# Altium schematic sheet ON_OFF.SchDoc
size A4
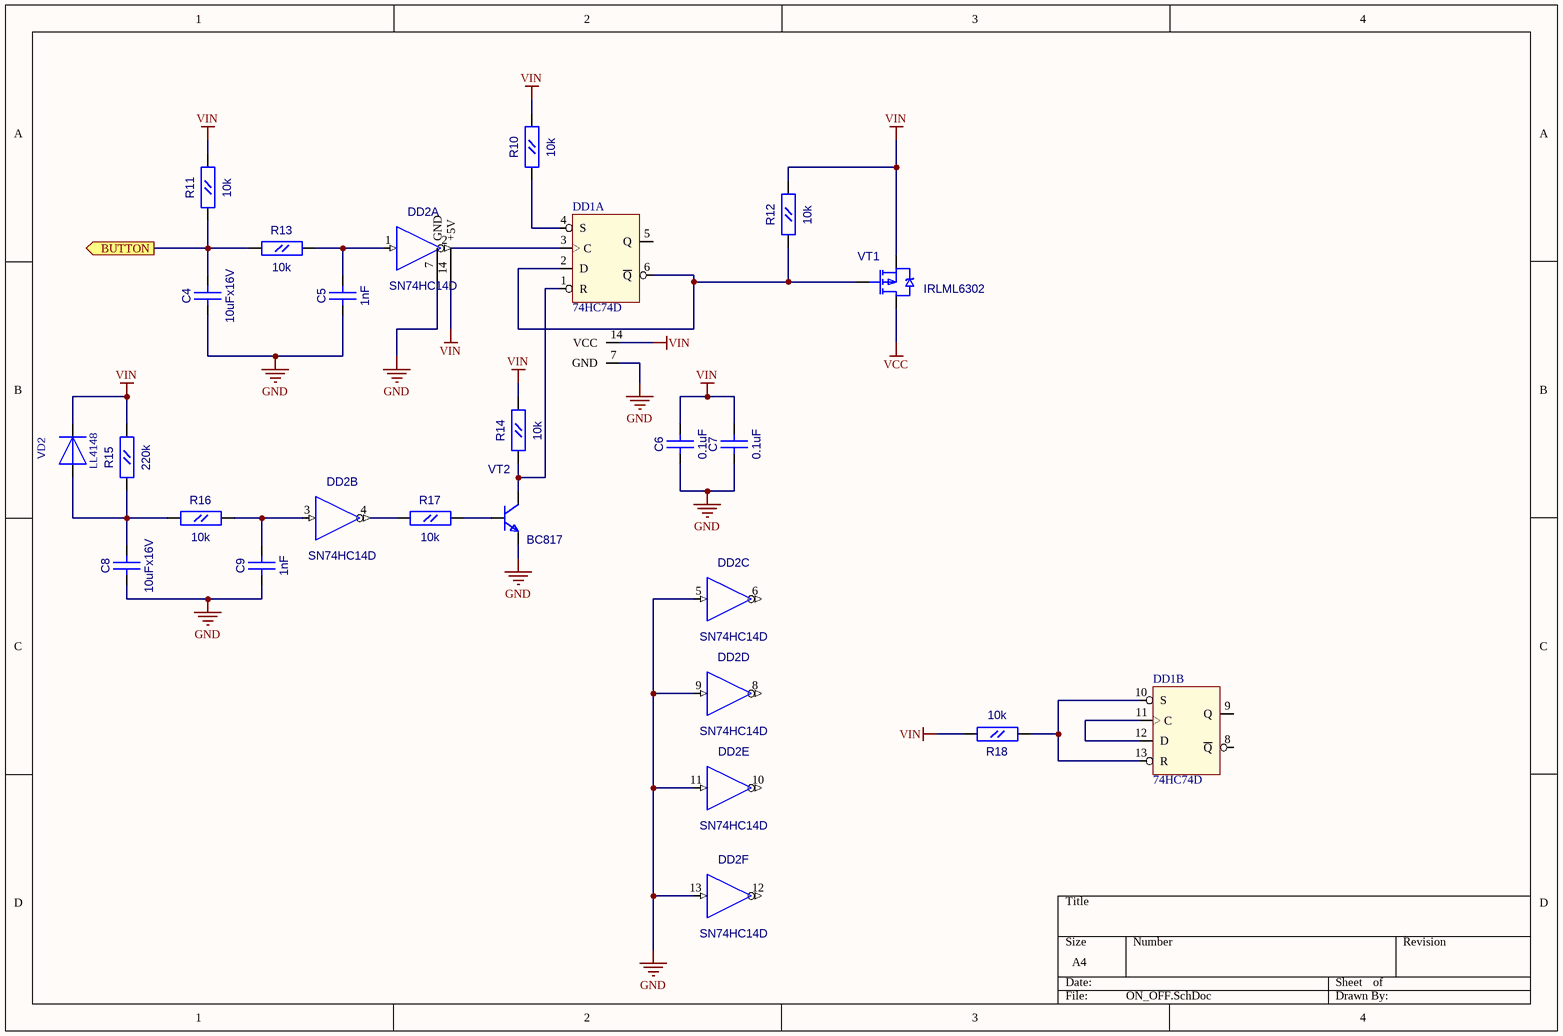
[diagram p0: ON_OFF.SchDoc]

## Parts
C4  10uFx16V  [CC0805]
C5  1nF  [CC0805]
C6  0.1uF  [CC0805]
C7  0.1uF  [CC0805]
C8  10uFx16V  [CC0805]
C9  1nF  [CC0805]
DD1  74HC74D  [SO14]  (parts A,B of 2)
DD2  SN74HC14D  [SO14]  (parts A,B,C,D,E,F of 6)
R10  10k  [RC0805]
R11  10k  [RC0805]
R12  10k  [RC0805]
R13  10k  [RC0805]
R14  10k  [RC0805]
R15  220k  [RC0805]
R16  10k  [RC0805]
R17  10k  [RC0805]
R18  10k  [RC0805]
VD2  LL4148  [SOD-80]
VT1  IRLML6302  [SOT-23(123)]
VT2  BC817  [SOT-23(123)]

## Ports
BUTTON (out)

## Nets
GND: C4.1(A) C5.1(A) C6.1(A) C7.1(A) C8.1(A) C9.1(A) DD1.7(GND) DD2.5(A) DD2.7(GND) DD2.9(A) DD2.11(A) DD2.13(A) VT2.2(E)
VCC: VT1.3(D)
VIN: C6.2(B) C7.2(B) DD1.14(VCC) DD2.14(+5V) R10.2(B) R11.2(B) R12.2(B) R14.2(B) R15.2(B) R18.2(B) VD2.2(+) VT1.2(S)
BUTTON: C4.2(B) R11.1(A) R13.1(A) ; port BUTTON
NetC5_2: C5.2(B) DD2.1(A) R13.2(B)
NetC8_2: C8.2(B) R15.1(A) R16.1(A) VD2.1(-)
NetC9_2: C9.2(B) DD2.3(A) R16.2(B)
NetDD1_1: DD1.1(R) R14.1(A) VT2.3(C)
NetDD1_2: DD1.2(D) DD1.6(~{Q}) R12.1(A) VT1.1(G)
NetDD1_3: DD1.3(C) DD2.2(Y)
NetDD1_4: DD1.4(S) R10.1(A)
NetDD1_10: DD1.10(S) DD1.13(R) R18.1(A)
NetDD1_11: DD1.11(C) DD1.12(D)
NetDD2_4: DD2.4(Y) R17.1(A)
NetR17_2: R17.2(B) VT2.1(B)

Not connected (* = marked no-connect by the designer): DD1 5(Q) 8(~{Q}) 9(Q); DD2 6(Y) 8(Y) 10(Y) 12(Y)

## Library data of the parts
C4-C9 = CC0805
  C4 C8: Value: 10uFx16V
  C5 C9: Value: 1nF
  C6 C7: Value: 0.1uF
DD2 = SN74HC14D: Hex Schmitt-Trigger INVERTERS; Value: *
R10-R18 = RC0805
  R10-R14 R16-R18: Value: 10k
  R15: Value: 220k
VT1 = IRLML6402: HEXFET Power MOSFET; ComponentField7: Published 8-Jun-2000; OriginalName: IRLML6302; Value: IRLML6302
VT2 = BC846BLT1: ComponentField7: Published 29-Sep-2000; OriginalName: BC846BLT1; Value: BC817
VD2 = LL4148: Value: *